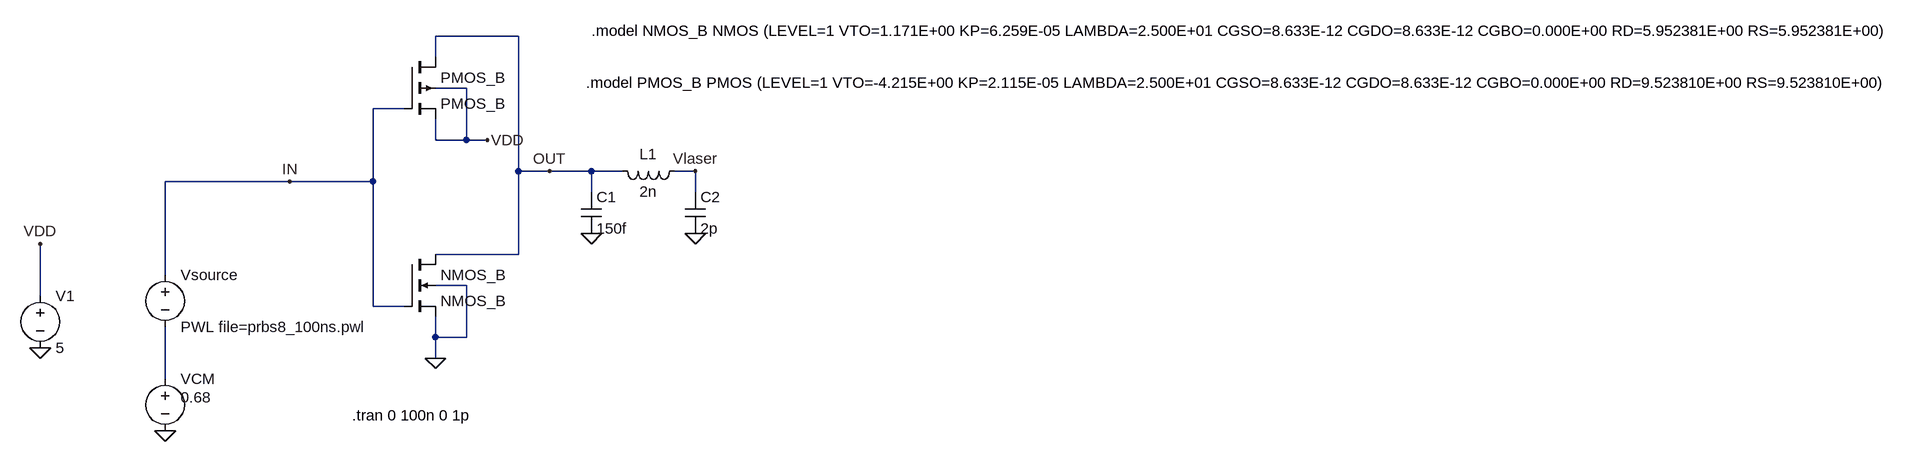
[diagram p0: schematic Circuit_Complet_B.asc]
Circuit_Complet_B.asc, the LTspice schematic file:
Version 4.1
SHEET 1 2556 680
WIRE 320 -416 192 -416
WIRE 192 -384 192 -416
WIRE 240 -336 192 -336
WIRE 144 -304 96 -304
WIRE 192 -256 192 -288
WIRE 240 -256 240 -336
WIRE 240 -256 192 -256
WIRE 272 -256 240 -256
WIRE 320 -208 320 -416
WIRE 368 -208 320 -208
WIRE 432 -208 368 -208
WIRE 480 -208 432 -208
WIRE 592 -208 560 -208
WIRE -32 -192 -224 -192
WIRE 96 -192 96 -304
WIRE 96 -192 -32 -192
WIRE 432 -176 432 -208
WIRE 592 -176 592 -208
WIRE 320 -80 320 -208
WIRE 320 -80 192 -80
WIRE -224 -48 -224 -192
WIRE 240 -32 192 -32
WIRE -416 -16 -416 -96
WIRE 96 0 96 -192
WIRE 144 0 96 0
WIRE 192 48 192 16
WIRE 240 48 240 -32
WIRE 240 48 192 48
WIRE 192 80 192 48
WIRE -224 112 -224 32
FLAG -224 192 0
FLAG 432 -112 0
FLAG 592 -112 0
FLAG -416 64 0
FLAG -416 -96 VDD
FLAG 192 80 0
FLAG 272 -256 VDD
FLAG 592 -208 Vlaser
FLAG -32 -192 IN
FLAG 368 -208 OUT
SYMBOL pmos4 144 -384 R0
SYMATTR InstName PMOS_B
SYMATTR Value PMOS_B
SYMATTR Value2 l=200n w=2u
SYMBOL nmos4 144 -80 R0
SYMATTR InstName NMOS_B
SYMATTR Value NMOS_B
SYMATTR Value2 l=200n w=2u
SYMBOL voltage -224 -64 R0
WINDOW 123 0 0 Left 0
WINDOW 39 0 0 Left 0
SYMATTR InstName Vsource
SYMATTR Value PWL file=prbs8_100ns.pwl
SYMBOL voltage -224 96 R0
WINDOW 3 24 44 Left 2
WINDOW 123 0 0 Left 0
WINDOW 39 0 0 Left 0
SYMATTR Value 0.68
SYMATTR InstName VCM
SYMBOL cap 416 -176 R0
SYMATTR InstName C1
SYMATTR Value 150f
SYMBOL cap 576 -176 R0
SYMATTR InstName C2
SYMATTR Value 2p
SYMBOL ind 576 -224 R90
WINDOW 0 5 56 VBottom 2
WINDOW 3 32 56 VTop 2
SYMATTR InstName L1
SYMATTR Value 2n
SYMATTR SpiceLine Rser=1m
SYMBOL voltage -416 -32 R0
WINDOW 123 0 0 Left 0
WINDOW 39 0 0 Left 0
SYMATTR InstName V1
SYMATTR Value 5
TEXT 432 -424 Left 2 !.model NMOS_B NMOS (LEVEL=1 VTO=1.171E+00 KP=6.259E-05 LAMBDA=2.500E+01 CGSO=8.633E-12 CGDO=8.633E-12 CGBO=0.000E+00 RD=5.952381E+00 RS=5.952381E+00)
TEXT 424 -344 Left 2 !.model PMOS_B PMOS (LEVEL=1 VTO=-4.215E+00 KP=2.115E-05 LAMBDA=2.500E+01 CGSO=8.633E-12 CGDO=8.633E-12 CGBO=0.000E+00 RD=9.523810E+00 RS=9.523810E+00)
TEXT 64 168 Left 2 !.tran 0 100n 0 1p

The netlist it stands for:
* Circuit_Complet_B.asc
M§PMOS_B OUT IN VDD VDD PMOS_B l=200n w=2u
M§NMOS_B OUT IN 0 0 NMOS_B l=200n w=2u
Vsource IN N001 PWL file=prbs8_100ns.pwl
VCM N001 0 0.68
C1 OUT 0 150f
C2 Vlaser 0 2p
L1 Vlaser OUT 2n Rser=1m
V1 VDD 0 5
.model NMOS NMOS
.model PMOS PMOS
.lib standard.mos
.model NMOS_B NMOS (LEVEL=1 VTO=1.171E+00 KP=6.259E-05 LAMBDA=2.500E+01 CGSO=8.633E-12 CGDO=8.633E-12 CGBO=0.000E+00 RD=5.952381E+00 RS=5.952381E+00)
.model PMOS_B PMOS (LEVEL=1 VTO=-4.215E+00 KP=2.115E-05 LAMBDA=2.500E+01 CGSO=8.633E-12 CGDO=8.633E-12 CGBO=0.000E+00 RD=9.523810E+00 RS=9.523810E+00)
.tran 0 100n 0 1p
.backanno
.end